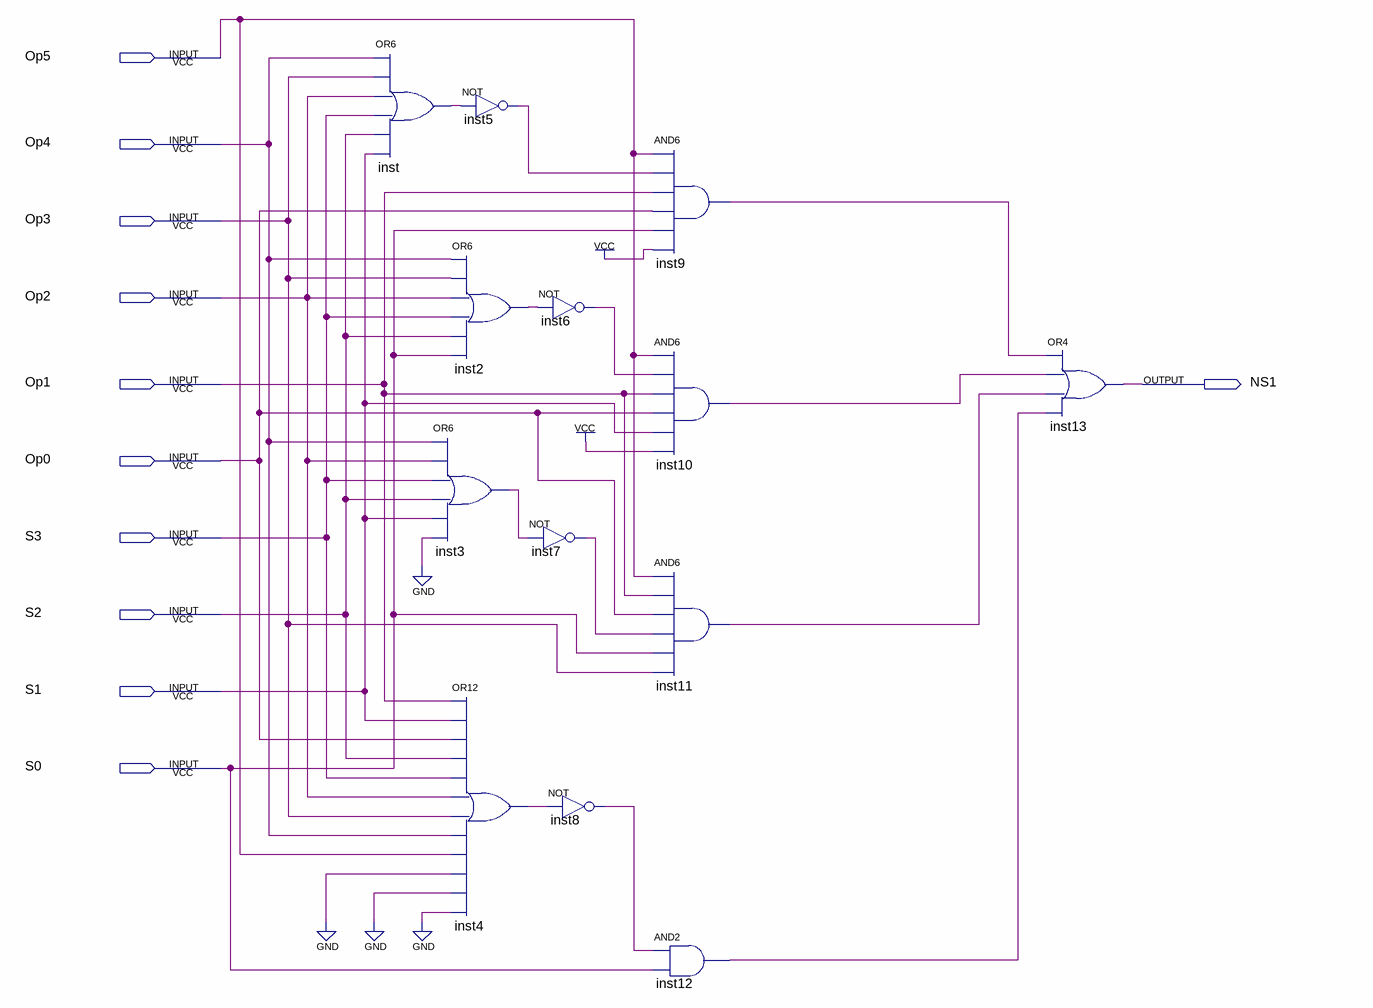
[diagram p0: schematic sheet]
// Quartus schematic NS1.bdf as structural Verilog: 13 symbols, 11 pins
module NS1 (
  input  Op5,
  input  Op4,
  input  Op3,
  input  Op2,
  input  Op1,
  input  Op0,
  input  S3,
  input  S2,
  input  S1,
  input  S0,
  output NS1
);

  wire inst2_out, inst3_out, inst4_out, inst5_out, inst6_out, inst7_out, inst8_out, inst9_out, inst10_out,
       inst11_out, inst12_out, inst_out;

  or inst (inst_out, Op4, Op3, Op2, S3, S2, S1);
  or inst2 (inst2_out, Op4, Op3, Op2, S3, S2, S0);
  or inst3 (inst3_out, Op4, Op2, S3, S2, S1, 1'b0);
  or inst4 (inst4_out, Op1, S1, Op0, S2, S3, Op2, Op3, Op4, Op5, 1'b0, 1'b0, 1'b0);
  not inst5 (inst5_out, inst_out);
  not inst7 (inst7_out, inst3_out);
  not inst6 (inst6_out, inst2_out);
  not inst8 (inst8_out, inst4_out);
  and inst9 (inst9_out, Op5, inst5_out, Op1, Op0, S0, 1'b1);
  and inst10 (inst10_out, Op5, inst6_out, Op1, Op0, S1, 1'b1);
  and inst11 (inst11_out, Op5, Op1, Op0, inst7_out, S0, Op3);
  and inst12 (inst12_out, inst8_out, S0);
  or inst13 (NS1, inst9_out, inst10_out, inst11_out, inst12_out);
endmodule
